# EAGLE design controller2 (EAGLE 7.6.0)
CNAME: timebox controller; CREVISION: 1.0; DESIGNER: volzo
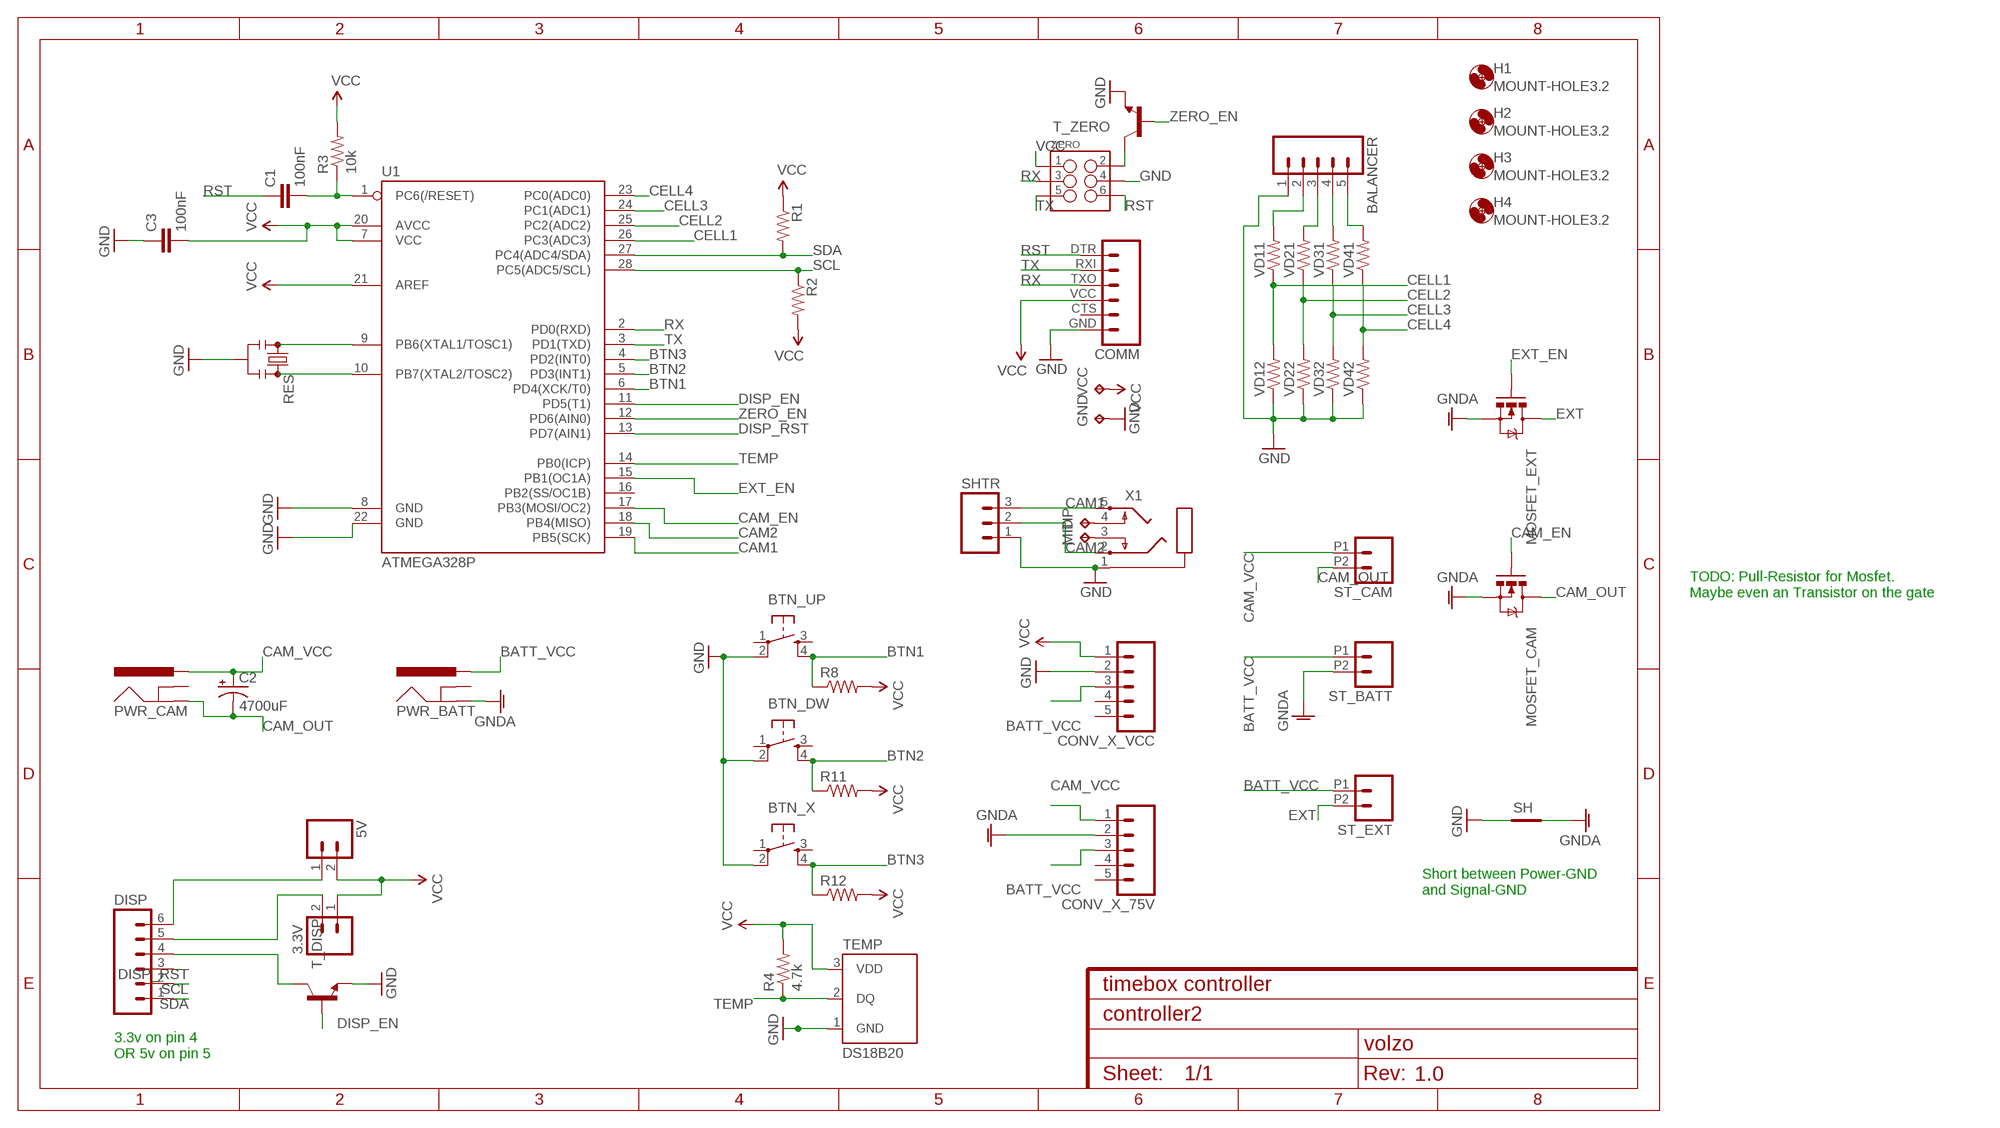
[diagram p0: schematic, sheet 1]

## Parts
3.3V  M02LOCK  [1X02_LOCK]
5V  M02LOCK  [1X02_LOCK]
BALANCER  M05LOCK  [1X05_LOCK]
BTN_DW  TAC_SWITCHPTH  [TACTILE-PTH]
BTN_UP  TAC_SWITCHPTH  [TACTILE-PTH]
BTN_X  TAC_SWITCHPTH  [TACTILE-PTH]
C1  100nF  CAPPTH  [CAP-PTH-SMALL]
C2  4700uF  CAP_POLPTH3  [CPOL-RADIAL-1000UF-63V]
C3  100nF  CAPPTH  [CAP-PTH-SMALL]
COMM  FTDI_BASICPTH  [FTDI_BASIC]
CONV_X_75V  M05LOCK  [1X05_LOCK]
CONV_X_VCC  M05LOCK  [1X05_LOCK]
DISP  M06FEMALE_LOCK  [1X06_FEMALE_LOCK.010]
GND  TPTP14SQ  [TP14SQ]
H1  MOUNT-HOLE3.2  [3,2]
H2  MOUNT-HOLE3.2  [3,2]
H3  MOUNT-HOLE3.2  [3,2]
H4  MOUNT-HOLE3.2  [3,2]
MID  TPTP14SQ  [TP14SQ]
MOSFET_CAM  MOSFET-NCHANNELFQP30N06L  [TO220V]
MOSFET_EXT  MOSFET-NCHANNELFQP30N06L  [TO220V]
PWR_BATT  POWER_JACKPTH_BREAD  [POWER_JACK_PTH_BREAD]
PWR_CAM  POWER_JACKPTH_BREAD  [POWER_JACK_PTH_BREAD]
R1  RESISTORAXIAL-0.3  [AXIAL-0.3]
R2  RESISTORAXIAL-0.3  [AXIAL-0.3]
R3  10k  RESISTORAXIAL-0.3  [AXIAL-0.3]
R4  4.7k  RESISTORAXIAL-0.3  [AXIAL-0.3]
R8  RESISTORAXIAL-0.3  [AXIAL-0.3]
R11  RESISTORAXIAL-0.3  [AXIAL-0.3]
R12  RESISTORAXIAL-0.3  [AXIAL-0.3]
RES  RESONATORPTH  [RESONATOR-PTH]
SH  SHORT-HT5  [SHORT_TOP-50]
SHTR  M03LOCK  [1X03_LOCK]
ST_BATT  M022.54MM_SCREWTERM  [1X02_2.54_SCREWTERM]
ST_CAM  M022.54MM_SCREWTERM  [1X02_2.54_SCREWTERM]
ST_EXT  M022.54MM_SCREWTERM  [1X02_2.54_SCREWTERM]
T_DISP  TRANSISTOR_NPN2N3904  [TO-92]
T_ZERO  TRANSISTOR_NPN2N3904  [TO-92]
TEMP  DS18B20  [TO-92-AMMO]
TIP  TPTP14SQ  [TP14SQ]
U1  ATMEGA328P  ATMEGA328P_PDIP  [DIL28-3]
VCC  TPTP14SQ  [TP14SQ]
VD11  RESISTORAXIAL-0.3  [AXIAL-0.3]
VD12  RESISTORAXIAL-0.3  [AXIAL-0.3]
VD21  RESISTORAXIAL-0.3  [AXIAL-0.3]
VD22  RESISTORAXIAL-0.3  [AXIAL-0.3]
VD31  RESISTORAXIAL-0.3  [AXIAL-0.3]
VD32  RESISTORAXIAL-0.3  [AXIAL-0.3]
VD41  RESISTORAXIAL-0.3  [AXIAL-0.3]
VD42  RESISTORAXIAL-0.3  [AXIAL-0.3]
X1  STEREOJACK  [STX3100]
ZERO  M03X2SHROUD  [2X3-SHROUDED]

## Nets
BATT_VCC [power]: CONV_X_75V.3 CONV_X_VCC.3 PWR_BATT.PWR ST_BATT.P1 ST_EXT.P1
BTN1: BTN_UP.4 R8.P$1 U1.6(PD4(XCK/T0))
BTN2: BTN_DW.4 R11.P$1 U1.5(PD3(INT1))
BTN3: BTN_X.4 R12.P$1 U1.4(PD2(INT0))
CAM1: SHTR.3 U1.19(PB5(SCK)) X1.5
CAM2: SHTR.2 U1.18(PB4(MISO)) X1.2
CAM_EN: MOSFET_CAM.1(G) U1.17(PB3(MOSI/OC2))
CAM_OUT [power]: C2.2(-) MOSFET_CAM.2(D) PWR_CAM.GND ST_CAM.P2
CAM_VCC [power]: C2.1(+) CONV_X_75V.1 PWR_CAM.PWR ST_CAM.P1
CELL1: U1.26(PC3(ADC3)) VD11.P$1 VD12.P$2
CELL2: U1.25(PC2(ADC2)) VD21.P$1 VD22.P$2
CELL3: U1.24(PC1(ADC1)) VD31.P$1 VD32.P$2
CELL4: U1.23(PC0(ADC0)) VD41.P$1 VD42.P$2
DISP_EN: T_DISP.2(B) U1.11(PD5(T1))
DISP_RST: DISP.3 U1.13(PD7(AIN1))
EXT [power]: MOSFET_EXT.2(D) ST_EXT.P2
EXT_EN: MOSFET_EXT.1(G) U1.15(PB1(OC1A))
GND: BALANCER.1 BTN_DW.2 BTN_UP.2 BTN_X.2 C3.1 COMM.GND CONV_X_VCC.2 GND.TP RES.2 SH.1 SHTR.1 T_DISP.1(E) T_ZERO.1(E) TEMP.1(GND) U1.8(GND) U1.22(GND) VD12.P$1 VD22.P$1 VD32.P$1 VD42.P$1 X1.1 ZERO.4
GNDA [power]: CONV_X_75V.2 MOSFET_CAM.3(S) MOSFET_EXT.3(S) PWR_BATT.GND SH.2 ST_BATT.P2
N$1: C1.2 R3.P$1 U1.1(PC6(/RESET))
N$2: 5V.1 DISP.6
N$3: 3.3V.2 DISP.5
N$4: BALANCER.2 VD11.P$2
N$5: BALANCER.3 VD21.P$2
N$6: DISP.4 T_DISP.3(C)
N$8: RES.3 U1.10(PB7(XTAL2/TOSC2))
N$9: RES.1 U1.9(PB6(XTAL1/TOSC1))
N$10: BALANCER.4 VD31.P$2
N$11: BALANCER.5 VD41.P$2
N$12: T_ZERO.3(C) ZERO.2
N$13: TIP.TP X1.4
N$14: MID.TP X1.3
RST: C1.1 COMM.DTR ZERO.6
RX: COMM.TXO U1.2(PD0(RXD)) ZERO.3
SCL: DISP.2 R2.P$1 U1.28(PC5(ADC5/SCL))
SDA: DISP.1 R1.P$2 U1.27(PC4(ADC4/SDA))
TEMP: R4.P$1 TEMP.2(DQ) U1.14(PB0(ICP))
TX: COMM.RXI U1.3(PD1(TXD)) ZERO.5
VCC: 3.3V.1 5V.2 C3.2 COMM.VCC CONV_X_VCC.1 R1.P$1 R2.P$2 R3.P$2 R4.P$2 R8.P$2 R11.P$2 R12.P$2 TEMP.3(VDD) U1.7(VCC) U1.20(AVCC) U1.21(AREF) VCC.TP ZERO.1
ZERO_EN: T_ZERO.2(B) U1.12(PD6(AIN0))
Unconnected: BTN_DW.1 BTN_DW.3 BTN_UP.1 BTN_UP.3 BTN_X.1 BTN_X.3 COMM.CTS CONV_X_75V.4 CONV_X_75V.5 CONV_X_VCC.4 CONV_X_VCC.5 PWR_BATT.GNDBREAK PWR_CAM.GNDBREAK U1.16(PB2(SS/OC1B))

## Notes on the sheet
- TODO: Pull-Resistor for Mosfet.
  Maybe even an Transistor on the gate
- Short between Power-GND
  and Signal-GND
- 3.3v on pin 4
  OR 5v on pin 5

## Library data of the parts
3.3V 5V ST_BATT ST_CAM ST_EXT = SparkFun-Connectors:M02: Standard 2-pin 0.1" header. Use with - straight break away headers ( PRT-00116) - right angle break away headers (PRT-00553) - swiss pins (PRT-00743) - machine pins (PRT-00117) - female headers (PRT-00115) Molex polarized connector foot print use with: PRT-08233 with associated crimp pins and housings. 2.54_SCREWTERM for use with PRT-10571. 3.5mm Screw Terminal footprints for PRT-08084 5mm Screw Terminal footprints for use with PRT-08432
BALANCER CONV_X_75V CONV_X_VCC = SparkFun-Connectors:M05: Header 5 Standard 5-pin 0.1" header. Use with straight break away headers (SKU : PRT-00116), right angle break away headers (PRT-00553), swiss pins (PRT-00743), machine pins (PRT-00117), and female headers (PRT-00115). Molex polarized connector foot print use with SKU : PRT-08230 with associated crimp pins and housings.
BTN_DW BTN_UP BTN_X = SparkFun-Retired:TAC_SWITCH: Momentary Switch Button commonly used for reset or general input. Spark Fun Electronics SKU : COM-00097 SMT- SWCH-08247
C1 C3 = SparkFun-Passives:CAP: Capacitor Standard 0603 ceramic capacitor, and 0.1" leaded capacitor.
C2 = SparkFun-Passives:CAP_POL: Capacitor Polarized These are standard SMD and PTH capacitors. Normally 10uF, 47uF, and 100uF in electrolytic and tantalum varieties. Always verify the external diameter of the through hole cap, it varies with capacity, voltage, and manufacturer. The EIA devices should be standard.
COMM = SparkFun-Connectors:FTDI_BASIC: FTDI Basic header with labels
DISP = SparkFun-Connectors:M06: Header 6 Standard 6-pin 0.1" header. Use with straight break away headers (SKU : PRT-00116), right angle break away headers (PRT-00553), swiss pins (PRT-00743), machine pins (PRT-00117), and female headers (PRT-00115). Molex polarized connector foot print use with SKU : PRT-08094 with associated crimp pins and housings. NOTES ON THE VARIANTS LOCK and LOCK_LONGPADS... This footprint was designed to help hold the alignment of a through-hole component (i.e. 6-pin header) while soldering it into place. You may notice that each hole has been shifted either up or down by 0.005 of an inch from it's more standard position (which is a perfectly straight line). This slight alteration caused the pins (the squares in the middle) to touch the edges of the holes. Because they are alternating, it causes a "brace" to hold the component in place. 0.005 has proven to be the perfect amount of "off-center" position when using our standard breakaway headers. Although looks a little odd when you look at the bare footprint, once you have a header in there, the alteration is very hard to notice. Also,if you push a header all the way into place, it is covered up entirely on the bottom side. This idea of altering the position of holes to aid alignment will be further integrated into the Sparkfun Library for other footprints. It can help hold any component with 3 or more connection pins.
GND MID TIP VCC = testpad:TP: Test pad
H1-H4 = holes:MOUNT-HOLE: MOUNTING HOLE with drill center marker
MOSFET_CAM MOSFET_EXT = SparkFun-DiscreteSemi:MOSFET-NCHANNEL: Common NMOSFET Parts MFG P/N Store ID Prod ID FDD8780 TRANS-09984 SI7820DN TRANS-11055 FDS6630A IC-08089 2N7002PW TRANS-11151 FQP30N06L COM-10213 TRANS-10060 BSS123LT1G TRANS-08345 BSS138 TRANS-00830 BS170 2N7000; PROD_ID: TRANS-10060
PWR_BATT PWR_CAM = SparkFun-Connectors:POWER_JACK: Power Jack This is the standard 5.5mm barrel jack for power. The PTH is the most common, proven, reliable, footprint. The Slot footprint only works if the mill layer is transmitted to the PCB fab house so be warned. Mating wall wart : TOL-00298 (and others); PROD_ID: PRT-10811
R1-R4 R8 R11 R12 VD11 VD12 VD21 VD22 VD31 VD32 VD41 VD42 = SparkFun-Resistors:RESISTOR: Resistor Basic schematic elements and footprints for 0603, 1206, and PTH resistors.
RES = SparkFun-FreqCtrl:RESONATOR: Resonator Small SMD resonator. Used, eg, on the Arduino Pro/ Pro Mini boards. 8MHz- XTAL-08895 16MHz- XTAL-08900
SH = shorts-old:SHORT-H: Short between two nets; BOM: no
SHTR = SparkFun-Connectors:M03: Header 3 Standard 3-pin 0.1" header. Use with straight break away headers (SKU : PRT-00116), right angle break away headers (PRT-00553), swiss pins (PRT-00743), machine pins (PRT-00117), and female headers (PRT-00115). Molex polarized connector foot print use with SKU : PRT-08232 with associated crimp pins and housings.
T_DISP T_ZERO = SparkFun-DiscreteSemi:TRANSISTOR_NPN: Generic NPN BJT MMBT2222A - TRANS-08049 (SOT-23, 1A 40V) MPSA42 - TRANS-09116 (SOT-23, 500mA 300V) MMBT5088LT1G - TRANS-11160 (SOT-23, 50 mA 30V) BC547 - COM-08928 <http://www.sparkfun.com/products/8928> (TO-92 45V 100mA) (1.Collector 2.Base 3.Emitter) 2N3904 - COM-00521 <http://www.sparkfun.com/products/521> (TO-92 40V 200mA) (1.Emitter 2.Base 3.Collector) P2N2222A - COM-12852 <http://www.sparkfun.com/products/12852> (TO-92 40V 600mA) (1.Collector 2.Base 3.Emitter); PROD_ID: TRANS-08447
TEMP = SparkFun-Sensors:DS18B20: Dallas/Maxim DS18B20 1-wire temperature sensor Datasheet: http://datasheets.maximintegrated.com/en/ds/DS18B20.pdf temp thermometer 1-wire one-wire one wire; STORE_ID: SEN-00245
U1 = SparkFun-DigitalIC:ATMEGA328P_PDIP: uC used in the Arduino 32kb flash, 1k EEPROM, 2k SRAM This is the through-hole version of this chip.
X1 = adafruit:STEREOJACK: MIC/HEADPHONE JACK Stereo jack with two switches. Kycon STX3100, CUI SJ1-3555NG and/or 4UCon 05544
ZERO = SparkFun-Connectors:M03X2: 2x3 .1" header. Shrouded, with keying- CONN-10681 SMT- CONN-11415 Pogo pins- HW-11044; PROD_ID: CONN-10681

## Net classes
0 default: width 0.254 mm
1 power: width 0.762 mm, clearance 0.254 mm

## Board
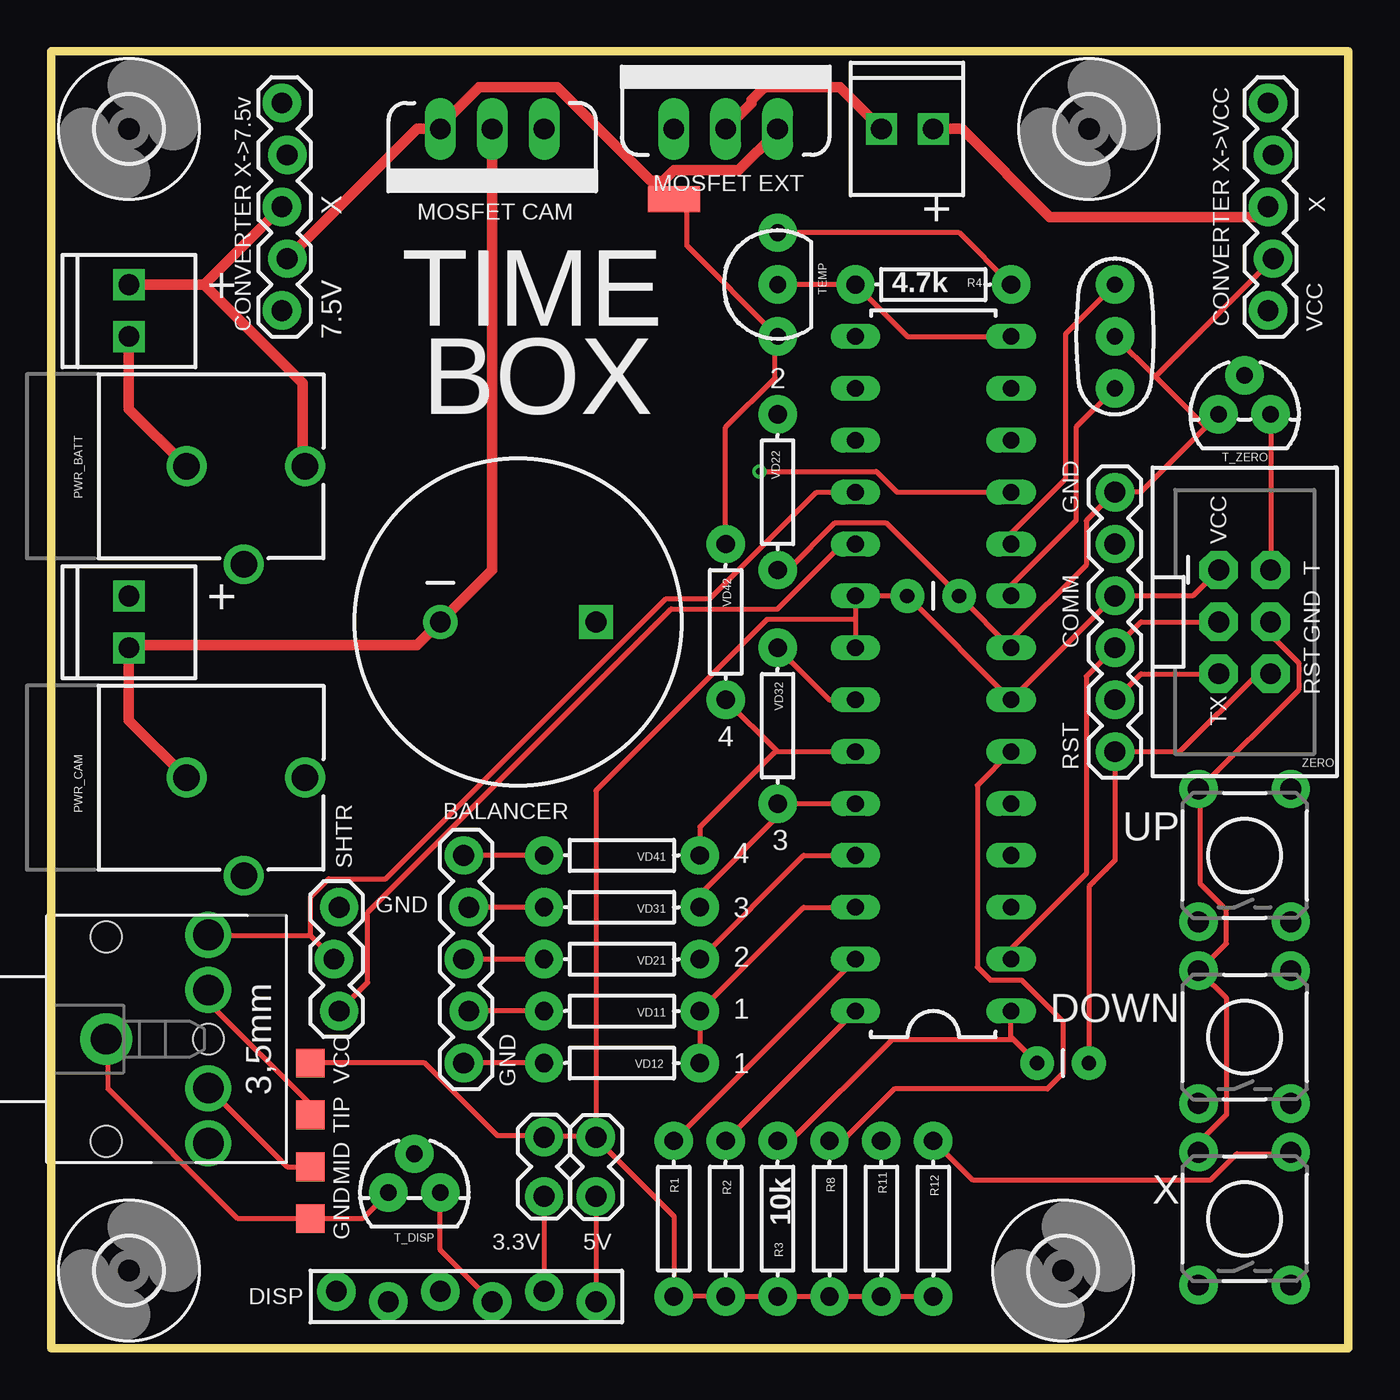
[diagram p1: board, top side]
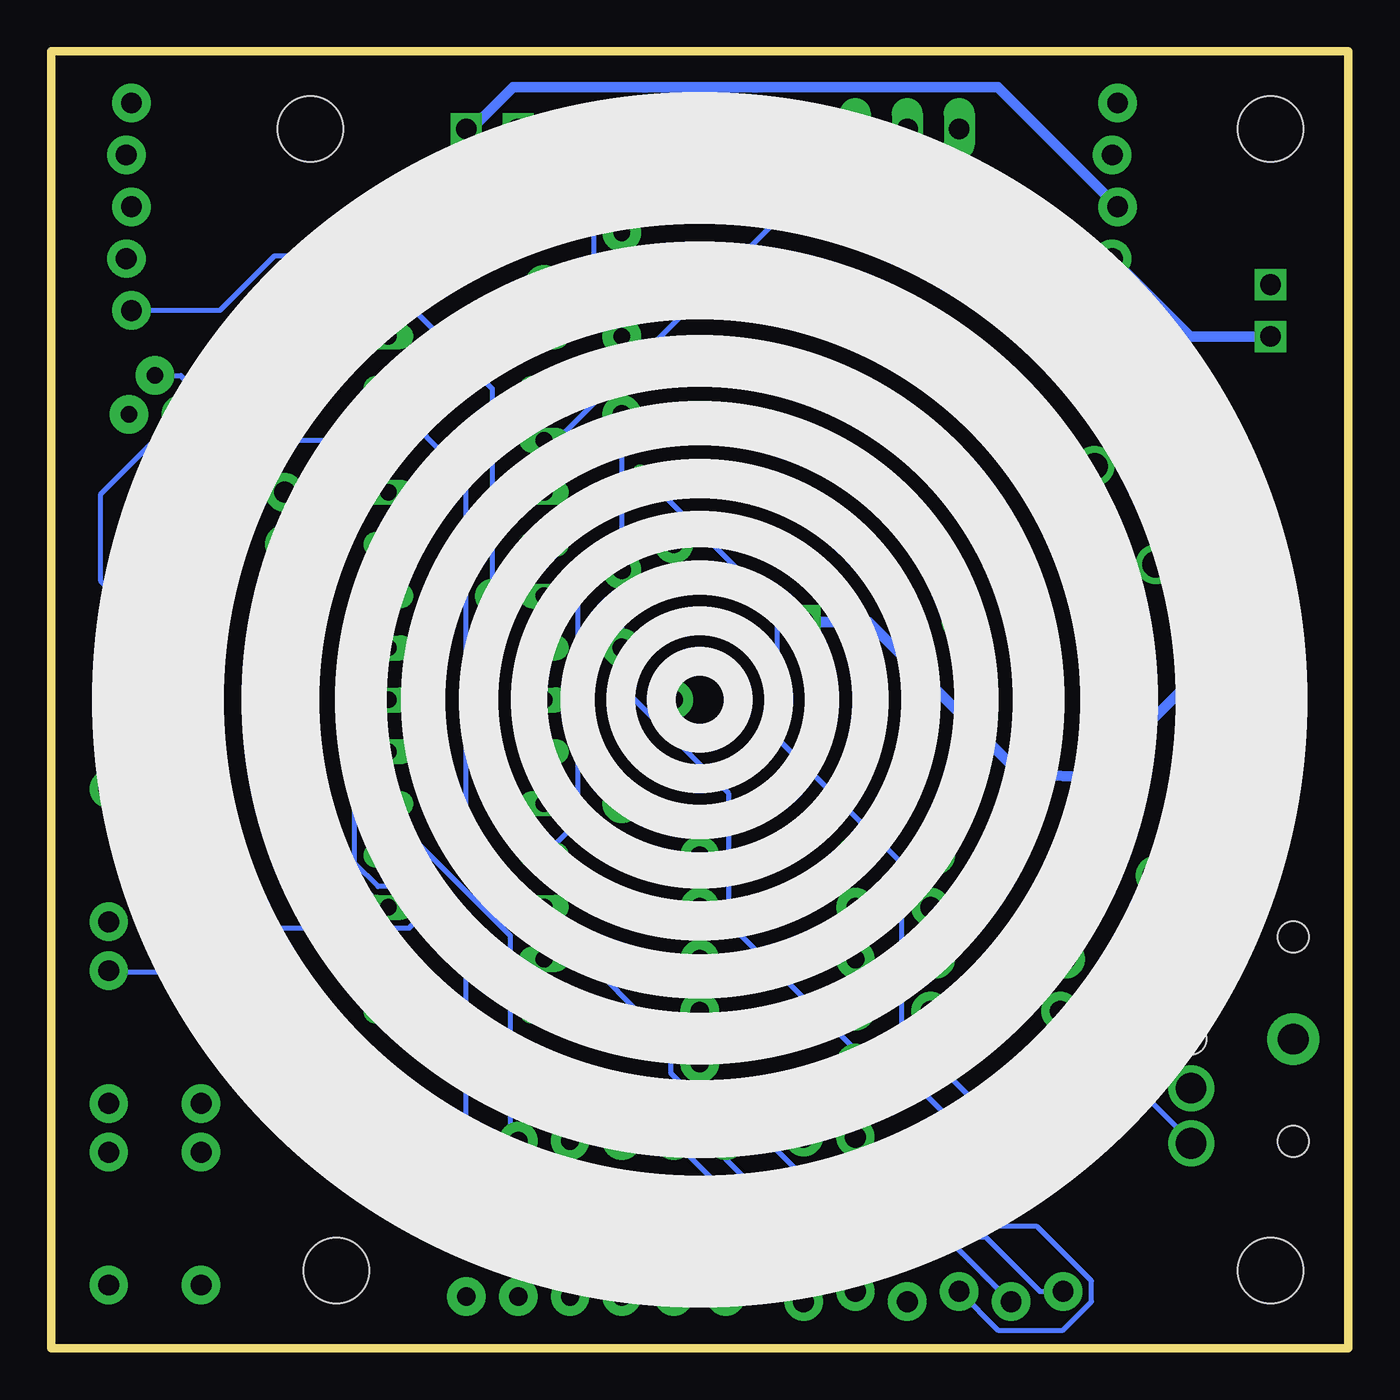
[diagram p2: board, bottom side, seen from below]

Size 63.5 x 63.5 mm. Coordinates in mm from the lower left corner, seen from the top.
Outline: 0,0 63.5,0 63.5,63.5 0,63.5 0,0
Copper layers (1*16): Top 0.0356mm / dielectric 1.5011mm / Bottom 0.0356mm
Design rules "oshpark-2layer *": minimum track width 6mil, minimum drill 13mil, track to track 10mil, track to pad 10mil, pad to pad 10mil, via to via 10mil, smd to smd 10mil, copper to edge 15mil, drill to drill 6mil, minimum pad ring 7mil, minimum via ring 7mil, stop-mask expansion 2.5mil, vias tented up to drill 0mil, thermal gap 10mil

### Footprints (pad centres in the part's own frame; a part is rotated, then mirrored left to right if it is on the bottom)
1X02_LOCK = drill 1.016 pad 1.88: 1 -0.178,0; 2 2.718,0
1X05_LOCK = drill 1.016 pad 1.88: 1 0,0.127; 2 2.54,-0.127; 3 5.08,0.127; 4 7.62,-0.127; 5 10.16,0.127
TACTILE-PTH = drill 1.016 pad 1.88: 1 -3.251,2.261; 2 3.251,2.261; 3 -3.251,-2.261; 4 3.251,-2.261
CAP-PTH-SMALL = drill 0.7 pad 1.651: 1 0,0; 2 2.54,0
CPOL-RADIAL-1000UF-63V = drill 1.016 pad 1.651 square: 1 3.81,0 | drill 1.016 pad 1.676: 2 -3.81,0
FTDI_BASIC = drill 1.016 pad 1.88: CTS 10.16,0; DTR 0,0; GND 12.7,0; RXI 2.54,0; TXO 5.08,0; VCC 7.62,0
1X06_FEMALE_LOCK.010 = drill 1.016 pad 1.88: 1 0,0.254; 2 2.54,-0.254; 3 5.08,0.254; 4 7.62,-0.254; 5 10.16,0.254; 6 12.7,-0.254
TP14SQ = smd 1.4 x 1.4: TP 0,0
3,2 = hole 3.2: 0,0
TO220V = drill 1.016 long: 1 -2.54,0; 2 0,0; 3 2.54,0
POWER_JACK_PTH_BREAD = drill 1.3: GND 0,7.9; GNDBREAK 4.8,10.7; PWR 0,13.7
AXIAL-0.3 = drill 0.9 pad 1.88: P$1 -3.81,0; P$2 3.81,0
RESONATOR-PTH = drill 0.8 pad 1.88: 1 -2.54,0; 2 0,0; 3 2.54,0
SHORT_TOP-50 = smd 1.27 x 1.27: 1 0.635,0; 2 -0.635,0
1X03_LOCK = drill 1.016 pad 1.88: 1 0,0.127; 2 2.54,-0.127; 3 5.08,0.127
1X02_2.54_SCREWTERM = drill 1.016 square: P1 2.54,0; P2 0,0
TO-92 = drill 0.813 pad 1.88: 1 -1.27,0; 2 0,1.905; 3 1.27,0
TO-92-AMMO = drill 0.813 pad 1.88: 1 -2.54,0; 2 0,0; 3 2.54,0
DIL28-3 = drill 0.813 long: 1 -16.51,-3.81; 2 -13.97,-3.81; 3 -11.43,-3.81; 4 -8.89,-3.81; 5 -6.35,-3.81; 6 -3.81,-3.81; 7 -1.27,-3.81; 8 1.27,-3.81; 9 3.81,-3.81; 10 6.35,-3.81; 11 8.89,-3.81; 12 11.43,-3.81; 13 13.97,-3.81; 14 16.51,-3.81; 15 16.51,3.81; 16 13.97,3.81; 17 11.43,3.81; 18 8.89,3.81; 19 6.35,3.81; 20 3.81,3.81; 21 1.27,3.81; 22 -1.27,3.81; 23 -3.81,3.81; 24 -6.35,3.81; 25 -8.89,3.81; 26 -11.43,3.81; 27 -13.97,3.81; 28 -16.51,3.81
STX3100 = drill 1.5 pad 2.54: 1 2.7,-0.1 | drill 1.5: 2 7.7,5; 3 7.7,2.3; 4 7.7,-2.5; 5 7.7,-5.2 | hole 1.5: 2.7,4.9; 2.7,-5.1; 7.7,-0.1
2X3-SHROUDED = drill 1.016 pad 1.88 octagon: 1 -1.27,2.54; 2 1.27,2.54; 3 -1.27,0; 4 1.27,0; 5 -1.27,-2.54; 6 1.27,-2.54

### Placement (x,y rotation side)
3.3V  24.13,10.16 270 top
5V  26.67,7.62 90 top
BALANCER  20.32,13.97 90 top
BTN_DW  58.42,15.24 90 top
BTN_UP  58.42,24.13 90 top
BTN_X  58.42,6.35 90 top
C1  50.8,13.97 180 top
C2  22.86,35.56 0 top
C3  44.45,36.83 180 top
COMM  52.07,29.21 90 top
CONV_X_75V  11.43,50.8 90 top
CONV_X_VCC  59.69,50.8 90 top
DISP  13.97,2.54 0 top
GND  12.7,6.35 0 top
H1  3.81,59.69 0 top
H2  49.53,3.81 0 top
H3  50.8,59.69 0 top
H4  3.81,3.81 0 top
MID  12.7,11.43 0 top
MOSFET_CAM  21.59,59.69 180 top
MOSFET_EXT  33.02,59.69 0 top
PWR_BATT  -1.27,43.18 270 top
PWR_CAM  -1.27,27.94 270 top
R1  30.48,6.35 90 top
R2  33.02,6.35 270 top
R3  35.56,6.35 270 top
R4  43.18,52.07 0 top
R8  38.1,6.35 270 top
R11  40.64,6.35 270 top
R12  43.18,6.35 270 top
RES  52.07,49.53 90 top
SH  30.48,56.26 0 top
SHTR  13.97,21.59 270 top
ST_BATT  3.81,49.53 90 top
ST_CAM  3.81,34.29 90 top
ST_EXT  40.64,59.69 0 top
T_DISP  17.78,7.62 0 top
T_ZERO  58.42,45.72 0 top
TEMP  35.56,52.07 90 top
TIP  12.7,8.89 0 top
U1  43.18,33.02 90 top
VCC  12.7,13.97 0 top
VD11  27.94,16.51 180 top
VD12  27.94,13.97 0 top
VD21  27.94,19.05 180 top
VD22  35.56,41.91 90 top
VD31  27.94,21.59 180 top
VD32  35.56,30.48 270 top
VD41  27.94,24.13 180 top
VD42  33.02,35.56 270 top
X1  0,15.24 0 top
ZERO  58.42,35.56 0 top

### Tracks (layer width: path | path; a pad name or v marks a point on that pad's centre or on a via)
BATT_VCC
  Top 0.508: ST_EXT.P1 44.58,59.69 48.9,55.37 59.05,55.37 CONV_X_VCC.3 | 7.49,52.07 ST_BATT.P1 | CONV_X_75V.3 7.49,52.07 | 7.49,52.07 12.32,47.24 12.32,43.18 PWR_BATT.PWR
  Bottom 0.508: ST_EXT.P1 42.93,59.69 40.89,61.72 17.14,61.72 CONV_X_75V.3
BTN1
  Top 0.254: R8.P$1 38.73,10.16 41.27,12.7 48.77,12.7 49.53,13.46 49.53,16 47.5,18.03 45.97,18.03 45.34,18.67 45.34,27.56 U1.6
  Bottom 0.254: U1.6 46.99,28.7 48.64,27.05 48.64,23.75 47.5,22.61 45.97,22.61 45.34,21.97 45.34,21.21 45.97,20.57 53.85,20.57 60.58,27.3 BTN_UP.4
BTN2
  Bottom 0.254: U1.5 46.99,26.16 41.02,20.19 41.02,10.54 R11.P$1 41.02,10.41 42.67,8.76 48.39,8.76 58.04,18.41 60.58,18.41 BTN_DW.4
BTN3
  Top 0.254: R12.P$1 45.09,8.26 56.77,8.26 58.04,9.53 60.58,9.53 BTN_X.4
  Bottom 0.254: U1.4 46.74,24.13 43.18,20.57 R12.P$1
CAM1
  Top 0.254: U1.19 38.73,39.37 35.56,36.2 30.35,36.2 15.49,21.34 15.49,17.91 SHTR.3
  Bottom 0.254: SHTR.3 7.75,10.16 X1.5
CAM2
  Top 0.254: U1.18 37.47,41.91 32.26,36.7 30.1,36.7 16.38,22.99 13.59,22.99 12.7,22.1 12.7,20.19 | SHTR.2 12.7,20.19 | 12.7,20.19 7.75,20.19 X1.2
CAM_EN
  Bottom 0.254: U1.17 38.73,44.45 24.13,59.05 MOSFET_CAM.1
CAM_OUT
  Top 0.508: PWR_CAM.GND 6.6,27.94 3.81,30.73 ST_CAM.P2 3.94,34.42 17.91,34.42 C2.2 21.59,38.1 MOSFET_CAM.2
CAM_VCC
  Bottom 0.508: C2.1 23.5,35.56 16,28.07 15.11,28.07 PWR_CAM.PWR 12.45,27.94 3.81,36.58 ST_CAM.P1 11.3,44.32 CONV_X_75V.1
CELL1
  Top 0.254: U1.26 36.83,21.59 VD11.P$1 VD12.P$2
CELL2
  Top 0.254: U1.25 36.83,24.13 VD21.P$1
  Bottom 0.254: VD22.P$2 35.56,40.01 37.72,37.85 37.72,25.78 U1.25
CELL3
  Top 0.254: U1.24 VD32.P$2 35.56,26.04 31.75,22.23 VD31.P$1
CELL4
  Top 0.254: U1.23 35.56,29.21 35.5,29.27 | VD42.P$2 35.5,29.27 | VD41.P$1 31.75,25.53 35.5,29.27
DISP_EN  (via drill 0.33)
  Top 0.254: U1.11 41.4,41.91 40.39,42.93 v34.67,42.93
  Bottom 0.254: v34.67,42.93 27.94,36.2 27.94,29.84 21.84,23.75 21.84,13.59 T_DISP.2
DISP_RST
  Bottom 0.254: U1.13 46.99,46.48 43.18,42.67 43.18,23.37 39.88,20.07 38.35,20.07 33.15,14.86 33.15,13.46 31.24,11.56 29.84,11.56 27.05,8.76 22.1,8.76 19.3,5.97 15.24,5.97 12.57,3.3 12.57,2.29 13.97,0.89 17.14,0.89 DISP.3
EXT
  Top 0.508: MOSFET_EXT.2 34.29,60.96 34.29,61.09 34.92,61.72 38.61,61.72 ST_EXT.P2
EXT_EN
  Bottom 0.254: U1.15 39.37,50.16 36.96,52.58 36.96,55.12 34.29,57.78 32.38,57.78 MOSFET_EXT.1
GND
  Top 0.254: T_DISP.1 15.24,6.35 GND.TP 9.14,6.35 2.79,12.7 2.79,15.11 X1.1 | VD12.P$1 BALANCER.1 | BTN_X.2 56.26,9.65 56.26,10.16 57.53,11.43 57.53,17.14 56.26,18.41 BTN_DW.2 56.26,18.54 57.53,19.81 57.53,21.46 56.26,22.73 56.26,27.3 BTN_UP.2 56.26,27.43 61.09,32.26 61.09,33.53 59.69,34.92 ZERO.4 | SH.1 31.11,53.98 TEMP.1 35.43,49.53 35.43,47.5 33.02,45.09 VD42.P$1 | U1.22 38.1,31.75 VD32.P$1 | 56.52,45.09 53.34,41.91 COMM.GND 50.67,40.51 50.67,38.35 46.86,34.54 U1.8 C3.1 40.89,40.39 38.35,40.39 36.07,38.1 VD22.P$1 | 56.52,45.09 54.04,47.56 | 54.04,47.56 RES.2 | 56.52,45.09 T_ZERO.1 | 54.04,47.56 CONV_X_VCC.2
  Bottom 0.254: SHTR.1 14.1,20.7 20.19,14.61 BALANCER.1 16.38,10.16 16.38,9.02 16.51,8.89 T_DISP.1 | VD42.P$1 34.29,39.37 VD22.P$1 VD32.P$1 35.56,32.38 30.35,27.18 30.35,20.83 24.13,14.61 VD12.P$1 | ZERO.4 59.69,36.2 61.09,37.59 61.09,41.78 T_ZERO.1
GNDA
  Top 0.508: ST_BATT.P2 3.81,45.97 6.6,43.18 PWR_BATT.GND | 29.84,57.02 SH.2 | 29.84,57.02 30.48,57.66 33.66,57.66 35.56,59.56 MOSFET_EXT.3 | CONV_X_75V.2 17.91,59.69 MOSFET_CAM.3 19.05,59.82 20.95,61.72 24.77,61.72 29.34,57.15 29.72,57.15 29.84,57.02
  Bottom 0.508: ST_BATT.P2 7.75,49.53 CONV_X_75V.2
N$1
  Top 0.254: U1.1 46.99,15.24 47.05,15.18 | C1.2 47.05,15.18 | R3.P$1 36.2,10.16 41.15,15.11 46.99,15.11 47.05,15.18
N$2
  Top 0.254: 5V.1 DISP.6
N$3
  Top 0.254: 3.3V.2 DISP.5
N$4
  Top 0.254: VD11.P$2 BALANCER.2
N$5
  Top 0.254: VD21.P$2 BALANCER.3
N$6
  Top 0.254: T_DISP.3 19.05,4.83 DISP.4
N$8
  Top 0.254: U1.10 46.99,39.88 49.66,42.55 49.66,49.66 RES.3
N$9
  Top 0.254: U1.9 46.99,37.34 50.16,40.51 50.16,45.09 RES.1
N$10
  Top 0.254: VD31.P$2 BALANCER.4
N$11
  Top 0.254: VD41.P$2 BALANCER.5
N$12
  Top 0.254: T_ZERO.3 ZERO.2
N$13
  Top 0.254: TIP.TP 11.56,8.89 7.75,12.7 X1.4
N$14
  Top 0.254: MID.TP 12.7,11.94 7.75,16.89 7.75,17.53 X1.3
RST
  Top 0.254: C1.1 50.8,22.61 52.07,23.88 COMM.DTR 55.24,29.21 59.05,33.02 ZERO.6
RX
  Top 0.254: U1.2 46.99,19.56 50.67,23.24 50.67,32.89 COMM.TXO 53.34,35.56 ZERO.3
SCL
  Top 0.254: R2.P$1 U1.28
  Bottom 0.254: DISP.2 19.18,4.95 27.81,4.95 R2.P$1
SDA
  Top 0.254: R1.P$2 U1.27
  Bottom 0.254: DISP.1 15.11,2.79 17.78,5.46 26.67,5.46 30.48,9.27 R1.P$2
TEMP
  Top 0.254: U1.14 41.91,49.53 R4.P$1 TEMP.2
TX
  Top 0.254: ZERO.5 53.34,33.02 COMM.RXI
  Bottom 0.254: U1.3 47.24,21.59 50.67,25.02 50.67,30.35 COMM.RXI
VCC
  Top 0.254: R12.P$2 R11.P$2 R8.P$2 R3.P$2 R2.P$2 R1.P$1 30.48,6.48 26.67,10.29 5V.2 26.67,10.41 | VCC.TP 18.29,13.97 21.84,10.41 24.13,10.41 | 24.13,10.41 26.67,10.41 | 24.13,10.41 3.3V.1 | ZERO.1 55.88,36.83 COMM.VCC U1.7 C3.2 U1.20 39.37,35.69 | 39.37,35.69 U1.21 | TEMP.3 44.45,54.61 R4.P$2 | 26.67,10.41 26.67,27.3 35.05,35.69 39.37,35.69
  Bottom 0.254: CONV_X_VCC.1 55.24,50.8 52.58,53.47 48.39,53.47 R4.P$2 41.91,46.99 C3.2
ZERO_EN
  Bottom 0.254: U1.12 53.98,44.45 57.15,47.62 T_ZERO.2

### Text on the board
tPlace: MOSFET EXT | + | X | X | MOSFET CAM | + | CONVERTER X->7.5v | TIME | CONVERTER X->VCC | VCC | 7.5V | 2 | BOX | GND | VCC | T | + | GND | COMM | RST | TX | 4 | RST | BALANCER | UP | 4 | 3 | SHTR | GND | 3 | 2 | DOWN | 1 | VCC | GND | 1 | TIP | X | MID | GND | 3.3V | 5V | DISP